# Altium project ButtonBoard.PrjPcb
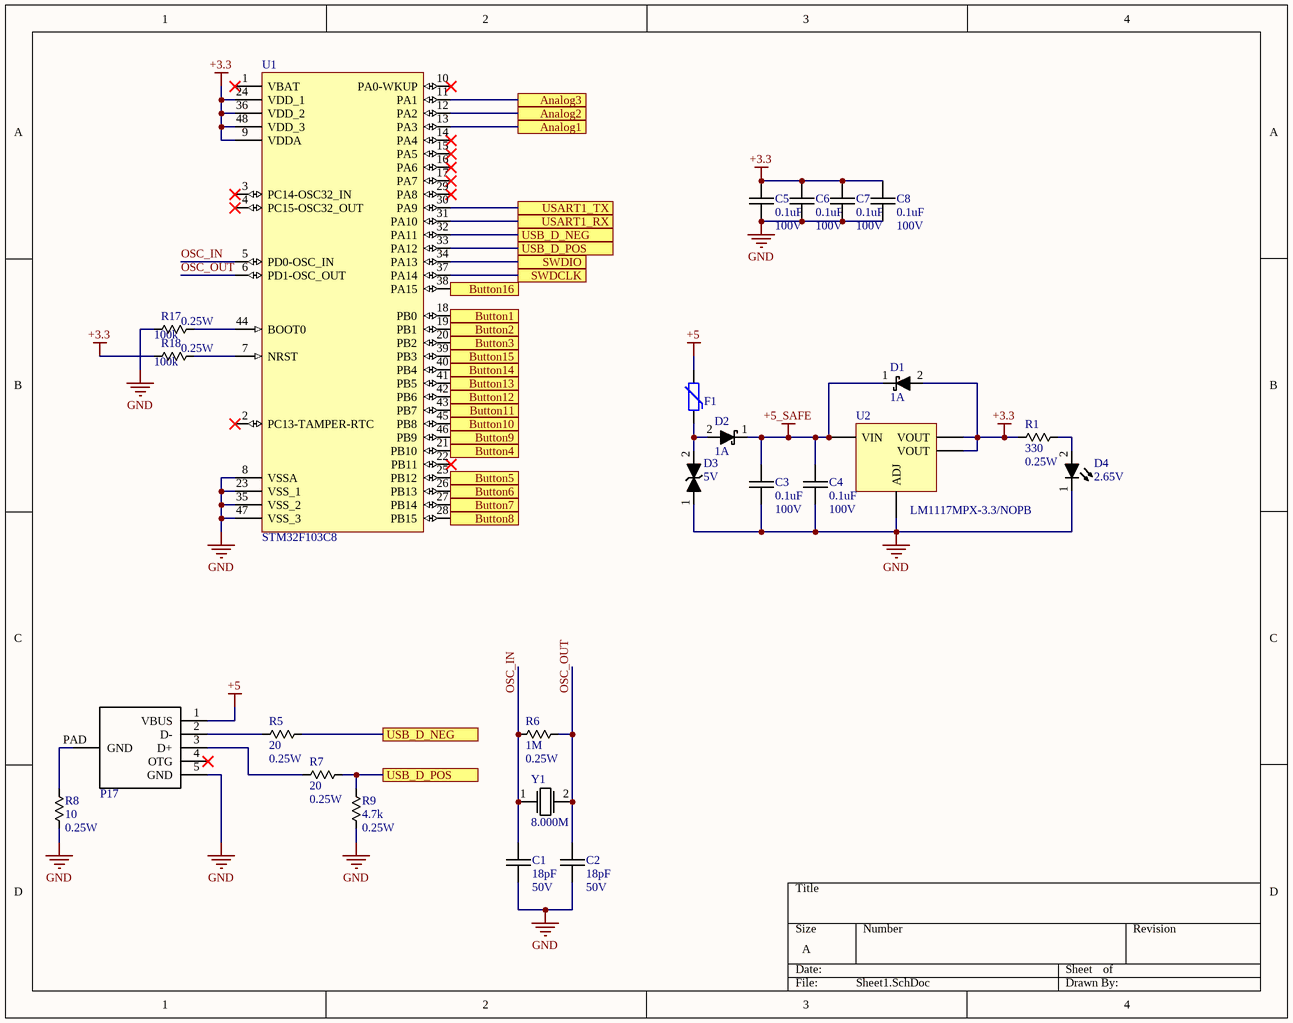
[diagram p0: Sheet1.SchDoc]
2 sheets, 63 parts. Net scope: flat (ports and power ports of the same name join across sheets).
Board file: Board.PcbDoc
Sheets:
  Sheet1.SchDoc
  IO.SchDoc

## Sheet Sheet1.SchDoc
size A

### Parts
C1  Capacitance: 18pF  Voltage Rating: 50V  [chip_0603]  (hidden comment: cap_single_np)
C2  Capacitance: 18pF  Voltage Rating: 50V  [chip_0603]  (hidden comment: cap_single_np)
C3  Capacitance: 0.1uF  Voltage Rating: 100V  [chip_0603]  (hidden comment: cap_single_np)
C4  Capacitance: 0.1uF  Voltage Rating: 100V  [chip_0603]  (hidden comment: cap_single_np)
C5  Capacitance: 0.1uF  Voltage Rating: 100V  [chip_0603]  (hidden comment: cap_single_np)
C6  Capacitance: 0.1uF  Voltage Rating: 100V  [chip_0603]  (hidden comment: cap_single_np)
C7  Capacitance: 0.1uF  Voltage Rating: 100V  [chip_0603]  (hidden comment: cap_single_np)
C8  Capacitance: 0.1uF  Voltage Rating: 100V  [chip_0603]  (hidden comment: cap_single_np)
D1  Current Rating: 1A  [sod123_0]  (hidden comment: diode_2)
D2  Current Rating: 1A  [sod123_0]  (hidden comment: diode_2)
D3  Reverse Breakdown Voltage: 5V  [sod323_0]  (hidden comment: diode_5)
D4  Forward Voltage: 2.65V  [chip_0603]  (hidden comment: diode_4)
F1  PTC_0  [chip_1206]  (value not drawn)
P17  usb_micro_b  [10118192]  (value not drawn)
R1  Resistance: 330  Power Rating: 0.25W  [chip_0603]  (hidden comment: res_single)
R5  Resistance: 20  Power Rating: 0.25W  [chip_0603]  (hidden comment: res_single)
R6  Resistance: 1M  Power Rating: 0.25W  [chip_0603]  (hidden comment: res_single)
R7  Resistance: 20  Power Rating: 0.25W  [chip_0603]  (hidden comment: res_single)
R8  Resistance: 10  Power Rating: 0.25W  [chip_0603]  (hidden comment: res_single)
R9  Resistance: 4.7k  Power Rating: 0.25W  [chip_0603]  (hidden comment: res_single)
R17  Resistance: 100k  Power Rating: 0.25W  [chip_0603]  (hidden comment: res_single)
R18  Resistance: 100k  Power Rating: 0.25W  [chip_0603]  (hidden comment: res_single)
U1  STM32F103C8  [LQFP48_0]
U2  Manufacturer PN: LM1117MPX-3.3/NOPB  [sot-223-4]  (hidden comment: LM1117)
Y1  Frequency: 8.000M  [ABLS_AT49_OSC]  (hidden comment: osc_xtal_2p_0)

### Ports
Analog1, Analog2, Analog3, Button1, Button2, Button3, Button4, Button5, Button6, Button7, Button8, Button9, Button10, Button11, Button12, Button13, Button14, Button15, Button16, SWDCLK, SWDIO, USART1_RX, USART1_TX, USB_D_NEG, USB_D_POS

### Nets
+3.3: C5.1 C6.1 C7.1 C8.1 D1.2 R1.1 R18.2 U1.9(VDDA) U1.24(VDD_1) U1.36(VDD_2) U1.48(VDD_3) U2.2(VOUT) U2.4(VOUT)
+5: F1.2 P17.1(VBUS)
+5_SAFE: C3.1 C4.1 D1.1 D2.1 U2.3(VIN)
GND: C1.2 C2.1 C3.2 C4.2 C5.2 C6.2 C7.2 C8.2 D3.1 D4.1 P17.5(GND) R8.2 R9.2 R17.2 U1.8(VSSA) U1.23(VSS_1) U1.35(VSS_2) U1.47(VSS_3) U2.1(ADJ)
OSC_IN: C1.1 R6.1 U1.5(PD0-OSC_IN) Y1.1
OSC_OUT: C2.2 R6.2 U1.6(PD1-OSC_OUT) Y1.2
NetD2_2: D2.2 D3.2 F1.1
NetD4_2: D4.2 R1.2
NetP2_2: U1.18(PB0) ; port Button1
NetP3_2: U1.25(PB12) ; port Button5
NetP5_2: U1.19(PB1) ; port Button2
NetP6_2: U1.26(PB13) ; port Button6
NetP7_2: U1.20(PB2) ; port Button3
NetP8_2: U1.27(PB14) ; port Button7
NetP10_2: U1.21(PB10) ; port Button4
NetP11_2: U1.28(PB15) ; port Button8
NetP12_2: U1.46(PB9) ; port Button9
NetP13_2: U1.41(PB5) ; port Button13
NetP14_2: U1.45(PB8) ; port Button10
NetP15_2: U1.40(PB4) ; port Button14
NetP16_2: U1.43(PB7) ; port Button11
NetP17_2: P17.2(D-) R5.1
NetP17_3: P17.3(D+) R7.1
NetP17_PAD: P17.PAD(GND) R8.1
NetP18_2: U1.39(PB3) ; port Button15
NetP19_2: U1.42(PB6) ; port Button12
NetP20_2: U1.38(PA15) ; port Button16
NetP21_2: U1.34(PA13) ; port SWDIO
NetP21_3: U1.37(PA14) ; port SWDCLK
NetP22_2: U1.30(PA9) ; port USART1_TX
NetP22_3: U1.31(PA10) ; port USART1_RX
NetR4_1: U1.13(PA3) ; port Analog1
NetR5_2: R5.2 U1.32(PA11) ; port USB_D_NEG
NetR7_2: R7.2 R9.1 U1.33(PA12) ; port USB_D_POS
NetR10_1: U1.12(PA2) ; port Analog2
NetR11_1: U1.11(PA1) ; port Analog3
NetR17_1: R17.1 U1.44(BOOT0)
NetR18_1: R18.1 U1.7(NRST)

Not connected (* = marked no-connect by the designer): P17 4(OTG)*; U1 1(VBAT)* 2(PC13-TAMPER-RTC)* 3(PC14-OSC32_IN)* 4(PC15-OSC32_OUT)* 10(PA0-WKUP)* 14(PA4)* 15(PA5)* 16(PA6)* 17(PA7)* 22(PB11)* 29(PA8)*

### Library data of the parts
C1 C2 = CAP-00409: CAP, 18pF, ±2%, 50V, C0G, 0603; Manufacturer: Murata; Manufacturer PN: GRM1885C1H180GA01D; Tolerance: ±2%; Part Number: CAP-00409; Type: C0G
C3-C8 = CAP-00477: CAP, 0.1uF, ±10%, 100V, X7R, 0603; Manufacturer: Murata; Manufacturer PN: GRM188R72A104KA35D; Tolerance: ±10%; Part Number: CAP-00477; Type: X7R
D1 D2 = DIO-00001: Dio Shtky, 1A, 0.55V, 40V, SOD-123; Manufacturer: ON Semi; Manufacturer PN: MBR140SFT1G; Forward Voltage: 550mV; Type: Schottky; Reverse Breakdown Voltage: 40V; Part Number: DIO-00001
D3 = DIO-00037: TVS, 5V, 500W; Manufacturer: ST; Manufacturer PN: ESDA8V2-1J; Forward Voltage: *; Type: TVS; Current Rating: *; Part Number: DIO-00037; Power Rating: 500W
D4 = DIO-00050: LED, Green, 0603, Low current, HELI2 Series; Manufacturer: Kingbright; Manufacturer PN: APT1608LZGCK; Reverse Breakdown Voltage: 5V; Current Rating: 30mA; Power Rating: 120mW; Type: LED; Part Number: DIO-00050; Cost: 0.58
F1 = MISC-00008: PTC Resettable fuse, 6V, 500mA, 1206; Manufacturer: Eaton; Manufacturer PN: PTS12066V050; TEMP_CO: *; Part Number: MISC-00008; Cost: 0.3
P17 = CONN-00011: USB Micro B Type Receptacle; Manufacturer: Amphenol; Positions per level: 5; Levels: 1; Current: 1.8; Part Number: CONN-00011; Type: USB Micro B; Manufacturer PN: 10118192
R1 = RES-00221: RES SMD 330 OHM 1% 1/4W 0603; Manufacturer: Panasonic; Manufacturer PN: ERJ-PA3F3300V; Tolerance: 1%; Part Number: RES-00221
R5 R7 = RES-00129: RES SMD 20 OHM 1% 1/4W 0603; Manufacturer: Panasonic; Manufacturer PN: ERJ-PA3F20R0V; Tolerance: 1%; Part Number: RES-00129
R6 = RES-00362: RES SMD 1M OHM 1% 1/4W 0603; Manufacturer: Panasonic; Manufacturer PN: ERJ-PA3F1004V; Tolerance: 1%; Part Number: RES-00362
R8 = RES-00116: RES SMD 10 OHM 1% 1/4W 0603; Manufacturer: Panasonic; Manufacturer PN: ERJ-PA3F10R0V; Tolerance: 1%; Part Number: RES-00116
R9 = RES-00470: RES SMD 4.7K OHM 1% 1/4W 0603; Manufacturer: Panasonic; Manufacturer PN: ERJ-PA3F4701V; Tolerance: 1%; Part Number: RES-00470
R17 R18 = RES-00301: RES SMD 100K OHM 1% 1/4W 0603; Manufacturer: Panasonic; Manufacturer PN: ERJ-PA3F1003V; Tolerance: 1%; Part Number: RES-00301
U1 = UCTRL-00008: STM32 M3, LQFP-48; Manufacturer: ST; Manufacturer PN: STM32F103C8; Part Number: UCTRL-00008
U2 = PWREG-00018: REG, Linear, Fixed 3V3, 800mA, SOT-223; Manufacturer: TI; Voltage Range In: 4.5 - 15V; Voltage Range Out: 3.3V; Part Number: PWREG-00018; Max Current: 800mA; Reg Type: Linear; Fixed/Adj: Fixed; Cost: 1.14
Y1 = OSC-00002: XTAL, 8MHz, 18pF, 20ppm; Manufacturer: Abracon; Manufacturer PN: ABLS-8.000MHZ-B2-T; ESR: 80; Stability: 50ppm; Load Capacitance: 18pF; Tolerance: 20ppm; Part Number: OSC-00002

## Sheet IO.SchDoc
size A
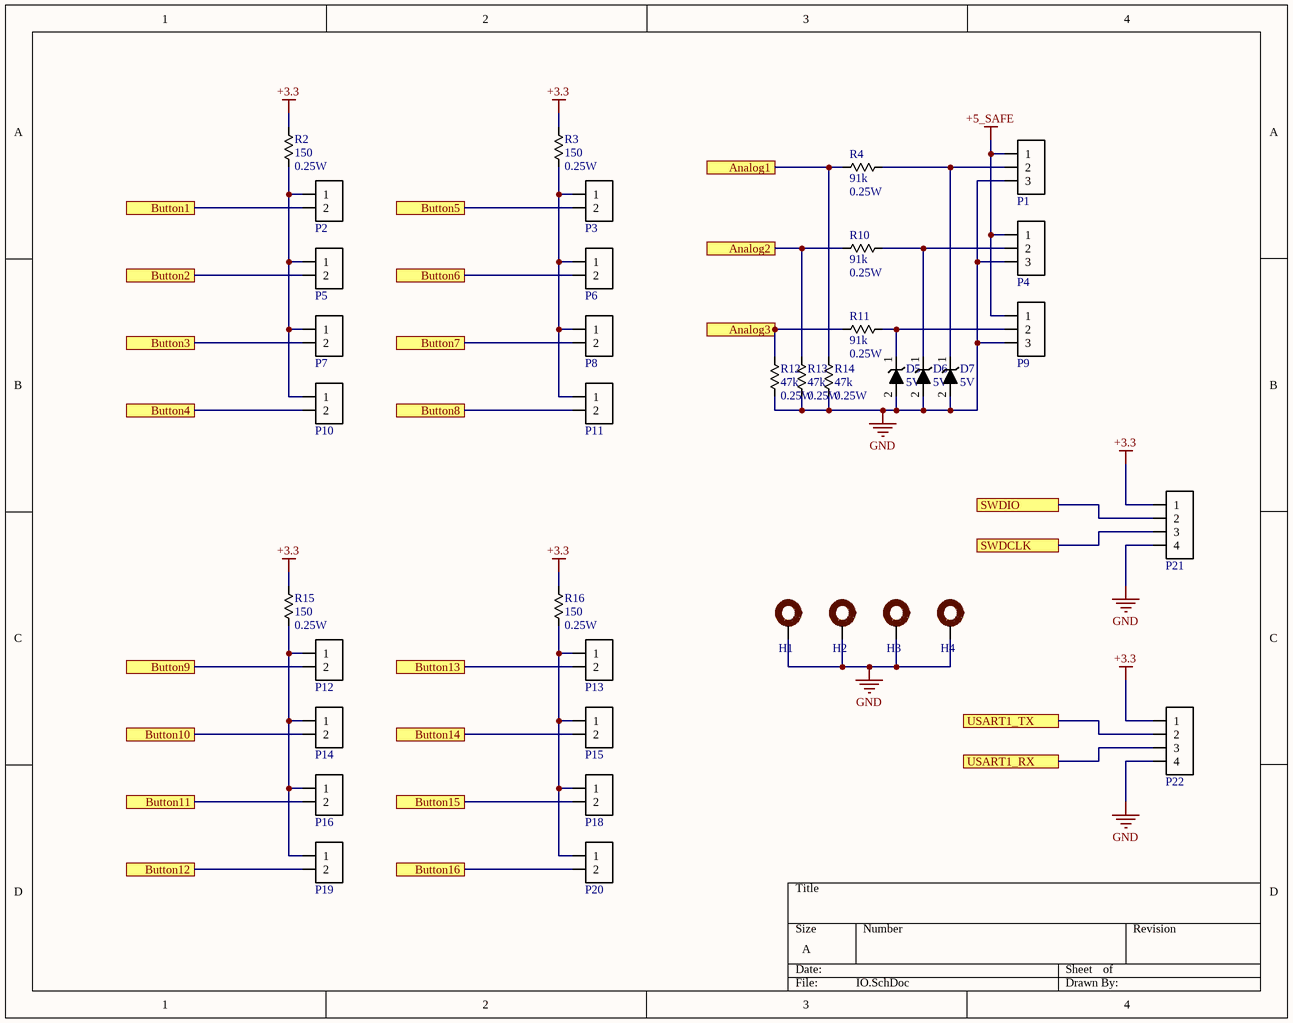
[diagram p1: IO.SchDoc]

### Parts
D5  Reverse Breakdown Voltage: 5V  [sod323_0]  (hidden comment: diode_1)
D6  Reverse Breakdown Voltage: 5V  [sod323_0]  (hidden comment: diode_1)
D7  Reverse Breakdown Voltage: 5V  [sod323_0]  (hidden comment: diode_1)
H1  mounting_hole_0  [#8-32_SOCKET_HEAD]  (value not drawn)
H2  mounting_hole_0  [#8-32_SOCKET_HEAD]  (value not drawn)
H3  mounting_hole_0  [#8-32_SOCKET_HEAD]  (value not drawn)
H4  mounting_hole_0  [#8-32_SOCKET_HEAD]  (value not drawn)
P1  conn-3x1_0  [JST_PHR_3_0]  (value not drawn)
P2  conn-2x1_0  [JST_PHR_2_0]  (value not drawn)
P3  conn-2x1_0  [JST_PHR_2_0]  (value not drawn)
P4  conn-3x1_0  [JST_PHR_3_0]  (value not drawn)
P5  conn-2x1_0  [JST_PHR_2_0]  (value not drawn)
P6  conn-2x1_0  [JST_PHR_2_0]  (value not drawn)
P7  conn-2x1_0  [JST_PHR_2_0]  (value not drawn)
P8  conn-2x1_0  [JST_PHR_2_0]  (value not drawn)
P9  conn-3x1_0  [JST_PHR_3_0]  (value not drawn)
P10  conn-2x1_0  [JST_PHR_2_0]  (value not drawn)
P11  conn-2x1_0  [JST_PHR_2_0]  (value not drawn)
P12  conn-2x1_0  [JST_PHR_2_0]  (value not drawn)
P13  conn-2x1_0  [JST_PHR_2_0]  (value not drawn)
P14  conn-2x1_0  [JST_PHR_2_0]  (value not drawn)
P15  conn-2x1_0  [JST_PHR_2_0]  (value not drawn)
P16  conn-2x1_0  [JST_PHR_2_0]  (value not drawn)
P18  conn-2x1_0  [JST_PHR_2_0]  (value not drawn)
P19  conn-2x1_0  [JST_PHR_2_0]  (value not drawn)
P20  conn-2x1_0  [JST_PHR_2_0]  (value not drawn)
P21  conn-4x1_0  [HDDR_4x1_0]  (value not drawn)
P22  conn-4x1_0  [HDDR_4x1_0]  (value not drawn)
R2  Resistance: 150  Power Rating: 0.25W  [chip_0603]  (hidden comment: res_single)
R3  Resistance: 150  Power Rating: 0.25W  [chip_0603]  (hidden comment: res_single)
R4  Resistance: 91k  Power Rating: 0.25W  [chip_0603]  (hidden comment: res_single)
R10  Resistance: 91k  Power Rating: 0.25W  [chip_0603]  (hidden comment: res_single)
R11  Resistance: 91k  Power Rating: 0.25W  [chip_0603]  (hidden comment: res_single)
R12  Resistance: 47k  Power Rating: 0.25W  [chip_0603]  (hidden comment: res_single)
R13  Resistance: 47k  Power Rating: 0.25W  [chip_0603]  (hidden comment: res_single)
R14  Resistance: 47k  Power Rating: 0.25W  [chip_0603]  (hidden comment: res_single)
R15  Resistance: 150  Power Rating: 0.25W  [chip_0603]  (hidden comment: res_single)
R16  Resistance: 150  Power Rating: 0.25W  [chip_0603]  (hidden comment: res_single)

### Ports
Analog1, Analog2, Analog3, Button1, Button2, Button3, Button4, Button5, Button6, Button7, Button8, Button9, Button10, Button11, Button12, Button13, Button14, Button15, Button16, SWDCLK, SWDIO, USART1_RX, USART1_TX

### Nets
+3.3: P21.1 P22.1 R2.2 R3.2 R15.2 R16.2
+5_SAFE: P1.1 P4.1 P9.1
GND: D5.2 D6.2 D7.2 H1.0(A) H2.0(A) H3.0(A) H4.0(A) P1.3 P4.3 P9.3 P21.4 P22.4 R12.2 R13.2 R14.2
NetD5_1: D5.1 P9.2 R11.2
NetD6_1: D6.1 P4.2 R10.2
NetD7_1: D7.1 P1.2 R4.2
NetP2_1: P2.1 P5.1 P7.1 P10.1 R2.1
NetP2_2: P2.2 ; port Button1
NetP3_1: P3.1 P6.1 P8.1 P11.1 R3.1
NetP3_2: P3.2 ; port Button5
NetP5_2: P5.2 ; port Button2
NetP6_2: P6.2 ; port Button6
NetP7_2: P7.2 ; port Button3
NetP8_2: P8.2 ; port Button7
NetP10_2: P10.2 ; port Button4
NetP11_2: P11.2 ; port Button8
NetP12_1: P12.1 P14.1 P16.1 P19.1 R15.1
NetP12_2: P12.2 ; port Button9
NetP13_1: P13.1 P15.1 P18.1 P20.1 R16.1
NetP13_2: P13.2 ; port Button13
NetP14_2: P14.2 ; port Button10
NetP15_2: P15.2 ; port Button14
NetP16_2: P16.2 ; port Button11
NetP18_2: P18.2 ; port Button15
NetP19_2: P19.2 ; port Button12
NetP20_2: P20.2 ; port Button16
NetP21_2: P21.2 ; port SWDIO
NetP21_3: P21.3 ; port SWDCLK
NetP22_2: P22.2 ; port USART1_TX
NetP22_3: P22.3 ; port USART1_RX
NetR4_1: R4.1 R14.1 ; port Analog1
NetR10_1: R10.1 R13.1 ; port Analog2
NetR11_1: R11.1 R12.1 ; port Analog3

### Library data of the parts
D5-D7 = DIO-00037: TVS, 5V, 500W, SOD-323; Manufacturer: ST; Manufacturer PN: ESDA8V2-1J; Type: TVS; Part Number: DIO-00037; Power Rating: 500W; Cost: 0.33
H1-H4 = MISC-00027: #8-32 Mounting Hole for Socket Head Cap Screw; Part Number: MISC-00027
P1 P4 P9 = CONN-00047: JST PH 3x1, THT, 2.00mm Pitch; Manufacturer PN: B3B-PH-K; Positions per level: 3; Levels: 1; Part Number: CONN-00047; Type: Header; Manufacturer: JST; Cost: 0.19
P2 P3 P5-P8 P10-P16 P18-P20 = CONN-00048: JST PH 2x1, THT, 2.00mm Pitch; Manufacturer PN: B2B-PH-K; Positions per level: 2; Levels: 1; Part Number: CONN-00048; Type: Header; Manufacturer: JST; Cost: 0.19
P21 P22 = CONN-00029: Header 4x1, 0.1"; Positions per level: 4; Levels: 1; Part Number: CONN-00029; Type: Header
R2 R3 R15 R16 = RES-00188: RES SMD 150 OHM 1% 1/4W 0603; Manufacturer: Panasonic; Manufacturer PN: ERJ-PA3F1500V; Tolerance: 1%; Part Number: RES-00188
R4 R10 R11 = RES-00586: RES SMD 91K OHM 1% 1/4W 0603; Manufacturer: Panasonic; Manufacturer PN: ERJ-PA3F9102V; Tolerance: 1%; Part Number: RES-00586
R12-R14 = RES-00492: RES SMD 47K OHM 1% 1/4W 0603; Manufacturer: Panasonic; Manufacturer PN: ERJ-PA3F4702V; Tolerance: 1%; Part Number: RES-00492

## Nets that join several sheets
+3.3: Sheet1 (13 pins), IO (6 pins)
+5_SAFE: Sheet1 (5 pins), IO (P1.1 P4.1 P9.1)
GND: Sheet1 (19 pins), IO (15 pins)
NetP2_2: Sheet1 (U1.18), IO (P2.2)
NetP3_2: Sheet1 (U1.25), IO (P3.2)
NetP5_2: Sheet1 (U1.19), IO (P5.2)
NetP6_2: Sheet1 (U1.26), IO (P6.2)
NetP7_2: Sheet1 (U1.20), IO (P7.2)
NetP8_2: Sheet1 (U1.27), IO (P8.2)
NetP10_2: Sheet1 (U1.21), IO (P10.2)
NetP11_2: Sheet1 (U1.28), IO (P11.2)
NetP12_2: Sheet1 (U1.46), IO (P12.2)
NetP13_2: Sheet1 (U1.41), IO (P13.2)
NetP14_2: Sheet1 (U1.45), IO (P14.2)
NetP15_2: Sheet1 (U1.40), IO (P15.2)
NetP16_2: Sheet1 (U1.43), IO (P16.2)
NetP18_2: Sheet1 (U1.39), IO (P18.2)
NetP19_2: Sheet1 (U1.42), IO (P19.2)
NetP20_2: Sheet1 (U1.38), IO (P20.2)
NetP21_2: Sheet1 (U1.34), IO (P21.2)
NetP21_3: Sheet1 (U1.37), IO (P21.3)
NetP22_2: Sheet1 (U1.30), IO (P22.2)
NetP22_3: Sheet1 (U1.31), IO (P22.3)
NetR4_1: Sheet1 (U1.13), IO (R4.1 R14.1)
NetR10_1: Sheet1 (U1.12), IO (R10.1 R13.1)
NetR11_1: Sheet1 (U1.11), IO (R11.1 R12.1)